# EAGLE schematic ebox (EAGLE 6.3)
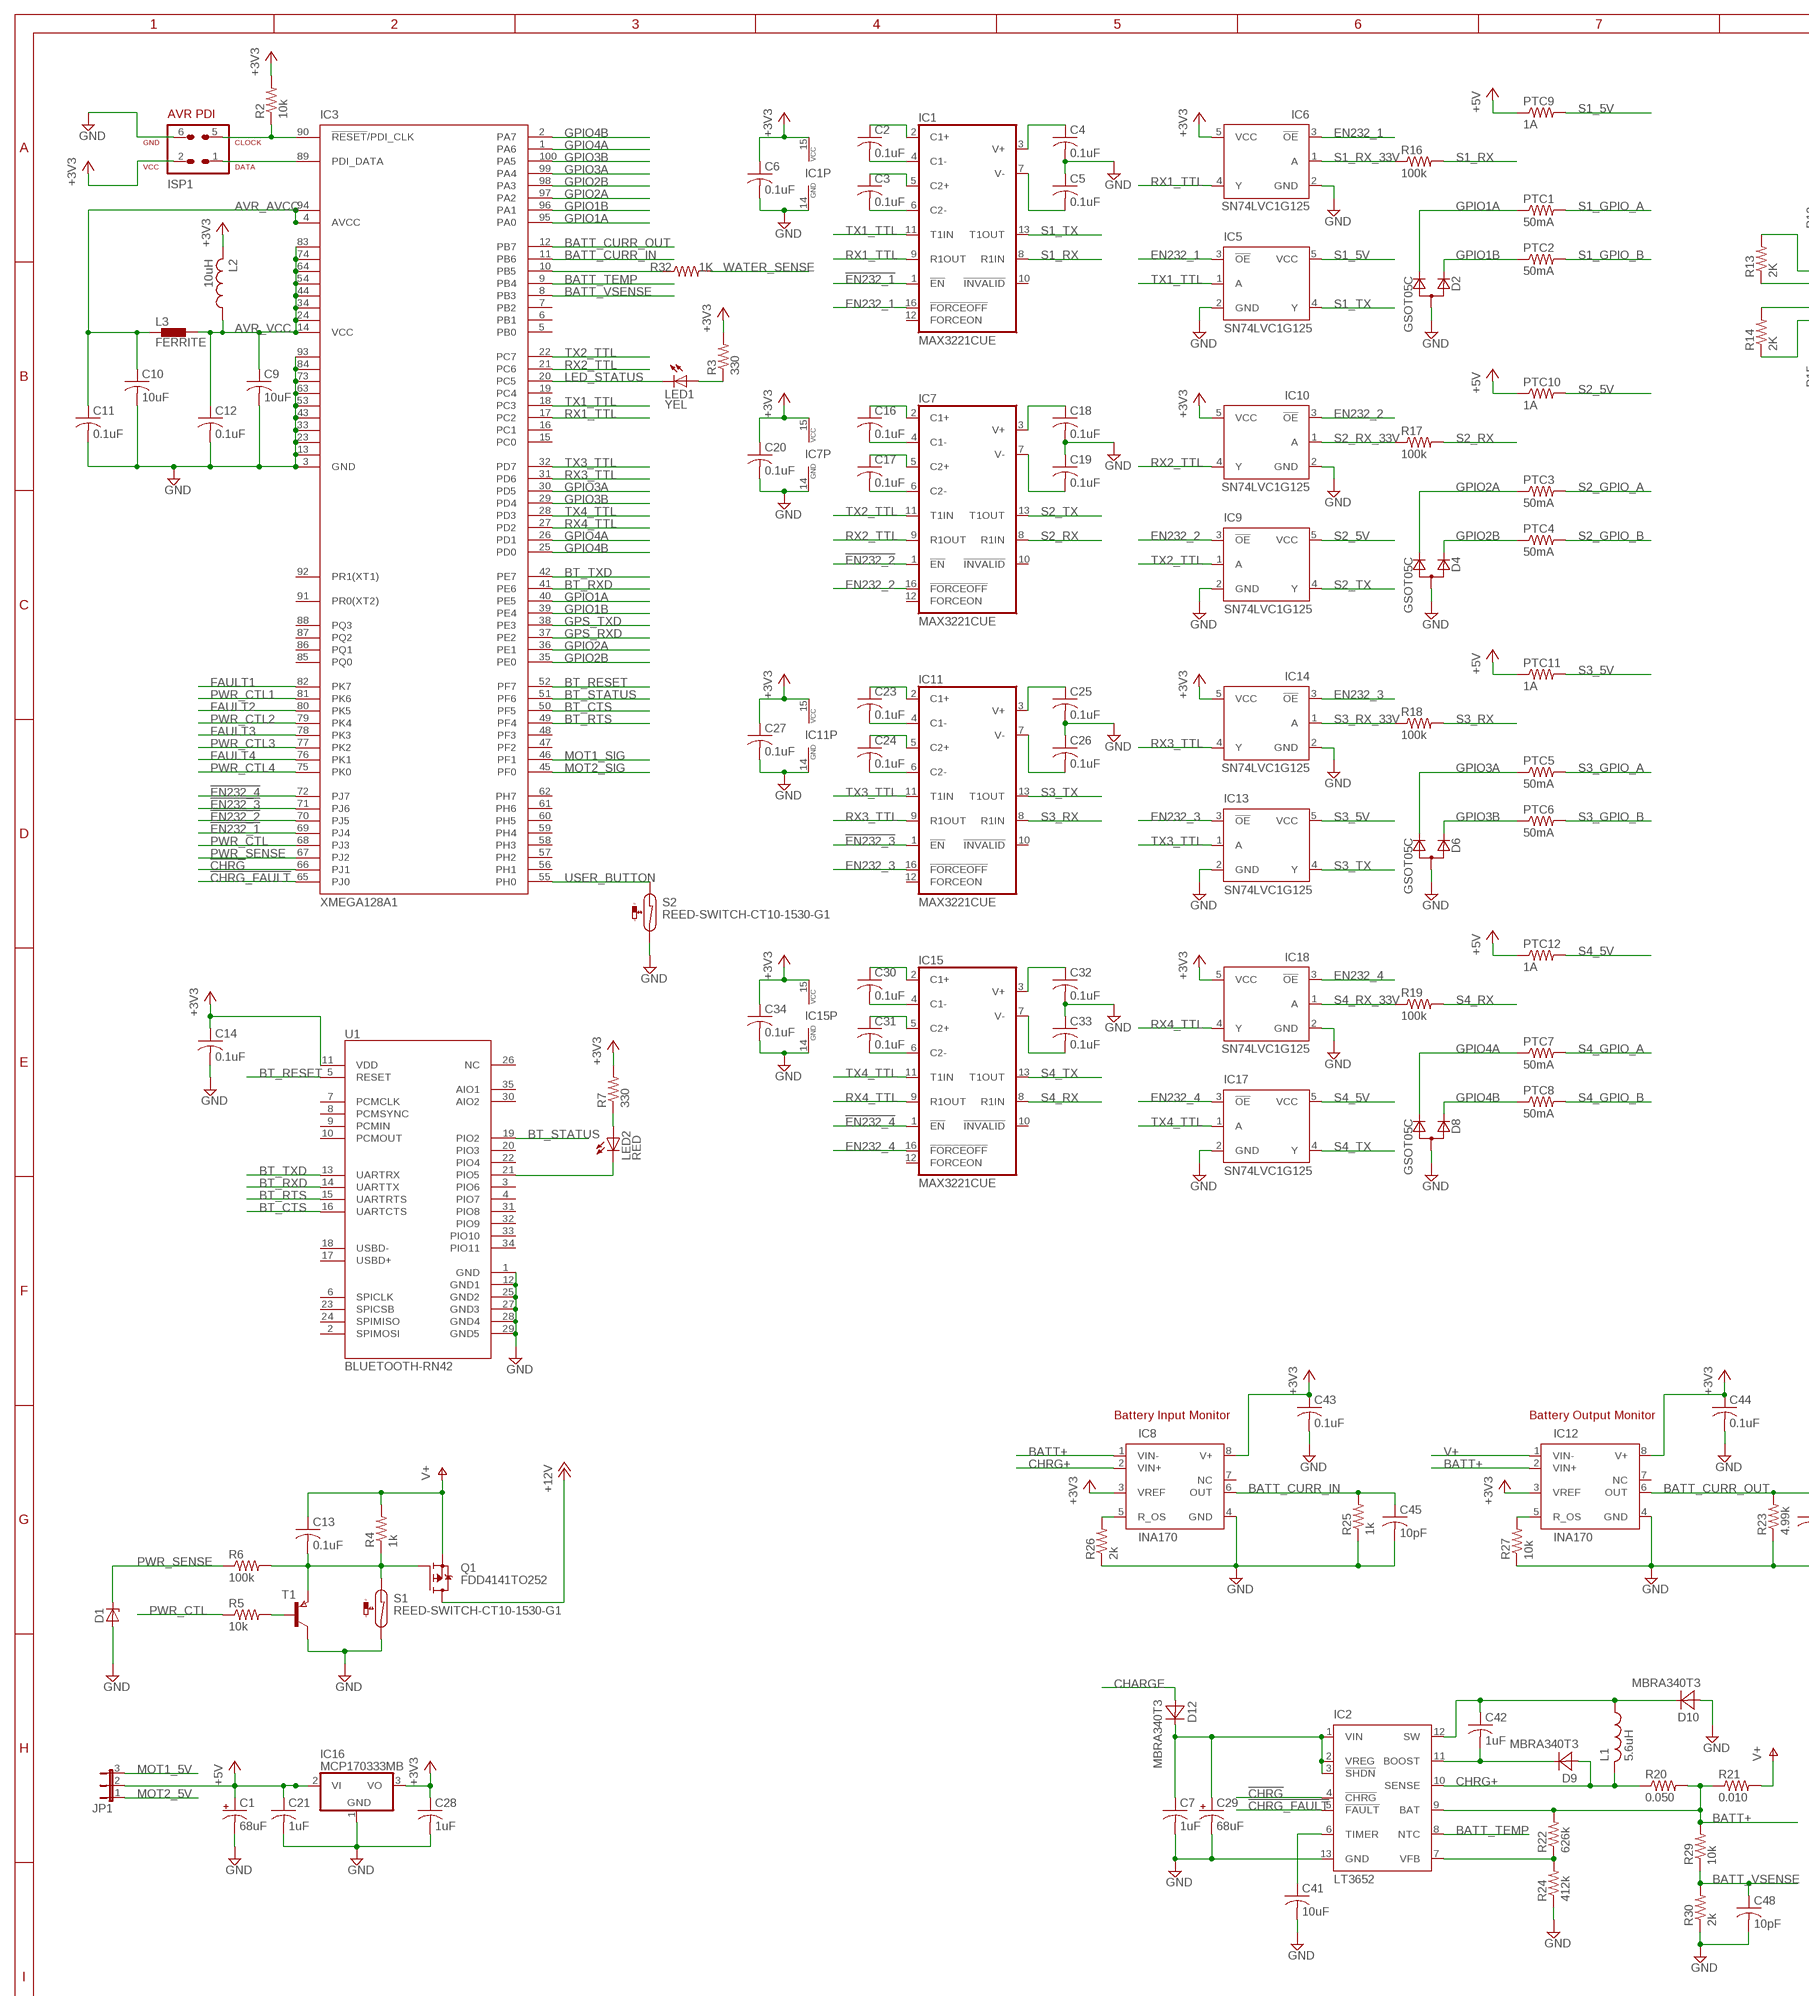
[diagram p0: schematic, sheet 1, part 1 of 2]
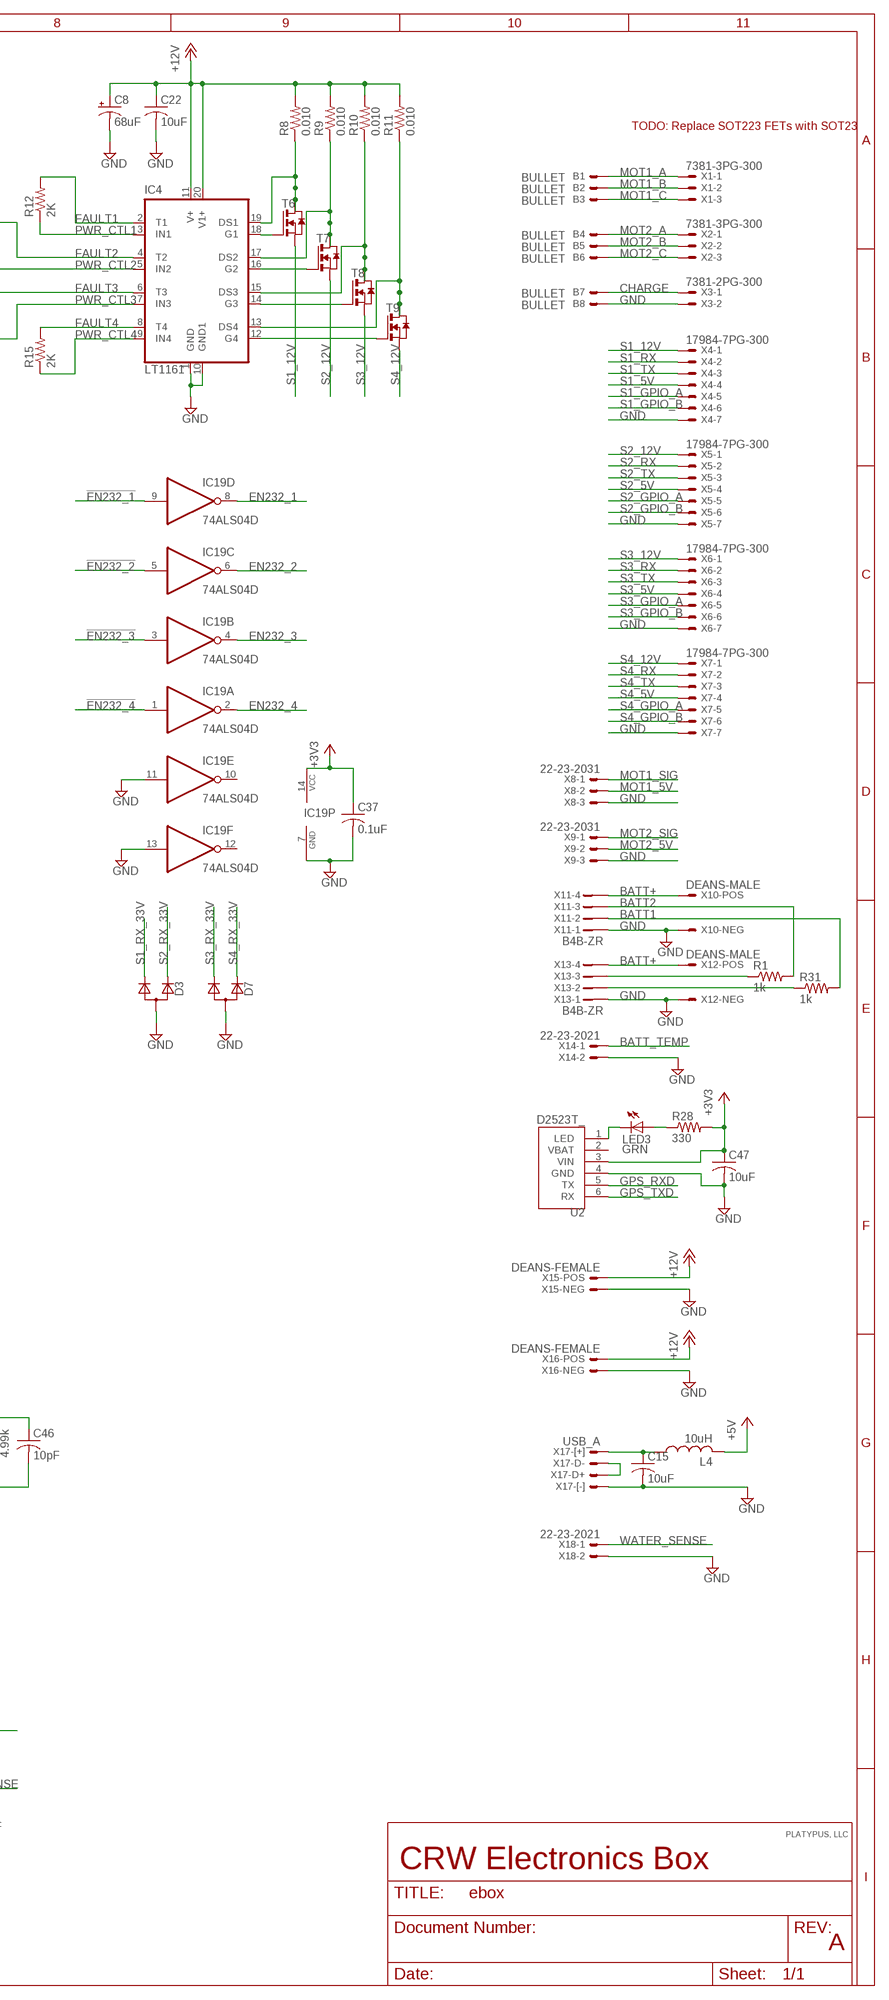
[diagram p1: schematic, sheet 1, part 2 of 2]

## Parts
B1  BULLET  [BULLET]
B2  BULLET  [BULLET]
B3  BULLET  [BULLET]
B4  BULLET  [BULLET]
B5  BULLET  [BULLET]
B6  BULLET  [BULLET]
B7  BULLET  [BULLET]
B8  BULLET  [BULLET]
C1  68uF  CPOL-USD  [PANASONIC_D]
C2  0.1uF  C-USC0805  [C0805]
C3  0.1uF  C-USC0805  [C0805]
C4  0.1uF  C-USC0805  [C0805]
C5  0.1uF  C-USC0805  [C0805]
C6  0.1uF  C-USC0805  [C0805]
C7  1uF  C-USC0805  [C0805]
C8  68uF  CPOL-USD  [PANASONIC_D]
C9  10uF  C-USC0805  [C0805]
C10  10uF  C-USC0805  [C0805]
C11  0.1uF  C-USC0805  [C0805]
C12  0.1uF  C-USC0805  [C0805]
C13  0.1uF  C-USC0805  [C0805]
C14  0.1uF  C-USC0805  [C0805]
C15  10uF  C-USC0805  [C0805]
C16  0.1uF  C-USC0805  [C0805]
C17  0.1uF  C-USC0805  [C0805]
C18  0.1uF  C-USC0805  [C0805]
C19  0.1uF  C-USC0805  [C0805]
C20  0.1uF  C-USC0805  [C0805]
C21  1uF  C-USC0805  [C0805]
C22  10uF  C-USC0805  [C0805]
C23  0.1uF  C-USC0805  [C0805]
C24  0.1uF  C-USC0805  [C0805]
C25  0.1uF  C-USC0805  [C0805]
C26  0.1uF  C-USC0805  [C0805]
C27  0.1uF  C-USC0805  [C0805]
C28  1uF  C-USC0805  [C0805]
C29  68uF  CPOL-USD  [PANASONIC_D]
C30  0.1uF  C-USC0805  [C0805]
C31  0.1uF  C-USC0805  [C0805]
C32  0.1uF  C-USC0805  [C0805]
C33  0.1uF  C-USC0805  [C0805]
C34  0.1uF  C-USC0805  [C0805]
C37  0.1uF  C-USC0805  [C0805]
C41  10uF  C-USC0805  [C0805]
C42  1uF  C-USC0805  [C0805]
C43  0.1uF  C-USC0805  [C0805]
C44  0.1uF  C-USC0805  [C0805]
C45  10pF  C-USC0805  [C0805]
C46  10pF  C-USC0805  [C0805]
C47  10uF  C-USC0805  [C0805]
C48  10pF  C-USC0805  [C0805]
D1  ZENER-DIODESOT23  [SOT23]
D2  GSOT05C  D_2CSOT23  [SOT-23]
D3  D_2CSOT23  [SOT-23]
D4  GSOT05C  D_2CSOT23  [SOT-23]
D6  GSOT05C  D_2CSOT23  [SOT-23]
D7  D_2CSOT23  [SOT-23]
D8  GSOT05C  D_2CSOT23  [SOT-23]
D9  MBRA340T3  [SMA]
D10  MBRA340T3  [SMA]
D12  MBRA340T3  [SMA]
IC1  MAX3221CUE  [TSSOP16]
IC2  LT3652  [MSOP12-MSE]
IC3  XMEGA128A1  [TQFP100]
IC4  LT1161  [SOIC20R]
IC5  SN74LVC1G125  [SOT23-DBV]
IC6  SN74LVC1G125  [SOT23-DBV]
IC7  MAX3221CUE  [TSSOP16]
IC8  INA170  [MSOP8]
IC9  SN74LVC1G125  [SOT23-DBV]
IC10  SN74LVC1G125  [SOT23-DBV]
IC11  MAX3221CUE  [TSSOP16]
IC12  INA170  [MSOP8]
IC13  SN74LVC1G125  [SOT23-DBV]
IC14  SN74LVC1G125  [SOT23-DBV]
IC15  MAX3221CUE  [TSSOP16]
IC16  MCP170333MB  [SOT89]
IC17  SN74LVC1G125  [SOT23-DBV]
IC18  SN74LVC1G125  [SOT23-DBV]
IC19  74ALS04D  [SO14]
ISP1  AVR-PDIVERT  [AVR-ISP-6]
JP1  JP2E  [JP2]
L1  5.6uH  IHLP-2020CZ-11  [IHLP-2020CZ-11]
L2  10uH  L-USL2012C  [L2012C]
L3  FERRITE  BML15HB121SN1  [0402]
L4  10uH  L-USL2012C  [L2012C]
LED1  YEL  LEDCHIPLED_1206  [CHIPLED_1206]
LED2  RED  LEDCHIPLED_1206  [CHIPLED_1206]
LED3  GRN  LEDCHIPLED_1206  [CHIPLED_1206]
PTC1  50mA  R-US_R1206  [R1206]
PTC2  50mA  R-US_R1206  [R1206]
PTC3  50mA  R-US_R1206  [R1206]
PTC4  50mA  R-US_R1206  [R1206]
PTC5  50mA  R-US_R1206  [R1206]
PTC6  50mA  R-US_R1206  [R1206]
PTC7  50mA  R-US_R1206  [R1206]
PTC8  50mA  R-US_R1206  [R1206]
PTC9  1A  R-US_R1206  [R1206]
PTC10  1A  R-US_R1206  [R1206]
PTC11  1A  R-US_R1206  [R1206]
PTC12  1A  R-US_R1206  [R1206]
Q1  FDD4141TO252  [TO252]
R1  1k  R-US_R0805  [R0805]
R2  10k  R-US_R0805  [R0805]
R3  330  R-US_R0805  [R0805]
R4  1k  R-US_R0805  [R0805]
R5  10k  R-US_R0805  [R0805]
R6  100k  R-US_R0805  [R0805]
R7  330  R-US_R0805  [R0805]
R8  0.010  R-US_R6332  [R6332]
R9  0.010  R-US_R6332  [R6332]
R10  0.010  R-US_R6332  [R6332]
R11  0.010  R-US_R6332  [R6332]
R12  2K  R-US_R0805  [R0805]
R13  2K  R-US_R0805  [R0805]
R14  2K  R-US_R0805  [R0805]
R15  2K  R-US_R0805  [R0805]
R16  100k  R-US_R0805  [R0805]
R17  100k  R-US_R0805  [R0805]
R18  100k  R-US_R0805  [R0805]
R19  100k  R-US_R0805  [R0805]
R20  0.050  R-US_R6332  [R6332]
R21  0.010  R-US_R6332  [R6332]
R22  626k  R-US_R0805  [R0805]
R23  4.99k  R-US_R0805  [R0805]
R24  412k  R-US_R0805  [R0805]
R25  1k  R-US_R0805  [R0805]
R26  2k  R-US_R0805  [R0805]
R27  10k  R-US_R0805  [R0805]
R28  330  R-US_R0805  [R0805]
R29  10k  R-US_R0805  [R0805]
R30  2k  R-US_R0805  [R0805]
R31  1k  R-US_R0805  [R0805]
R32  1K  R-US_R0805  [R0805]
S1  REED-SWITCH-CT10-1530-G1  [CT10-G1]
S2  REED-SWITCH-CT10-1530-G1  [CT10-G1]
T1  PNPSOT23  [SOT-23]
T6  NMOSSOT23-6  [SOT23-6]
T7  NMOSSOT23-6  [SOT23-6]
T8  NMOSSOT23-6  [SOT23-6]
T9  NMOSSOT23-6  [SOT23-6]
U1  BLUETOOTH-RN42  BLUETOOTH-RN41"  [RN41]
U2  D2523T_  [EM406]
U$1  PLATYPUS_LOGO  [PLATYPUS_LOGO_SMALL]
X1  7381-3PG-300  [7381-3PG-300]
X2  7381-3PG-300  [7381-3PG-300]
X3  7381-2PG-300  [7381-2PG-300]
X4  17984-7PG-300  [17984-7PG-300]
X5  17984-7PG-300  [17984-7PG-300]
X6  17984-7PG-300  [17984-7PG-300]
X7  17984-7PG-300  [17984-7PG-300]
X8  22-23-2031  [22-23-2031]
X9  22-23-2031  [22-23-2031]
X10  DEANS-MALE  [DEANS_MALE]
X11  B4B-ZR  [B4B-ZR]
X12  DEANS-MALE  [DEANS_MALE]
X13  B4B-ZR  [B4B-ZR]
X14  22-23-2021  [22-23-2021]
X15  DEANS-FEMALE  [DEANS_FEMALE]
X16  DEANS-FEMALE  [DEANS_FEMALE]
X17  USB_A  [1001-002-01100]
X18  22-23-2021  [22-23-2021]

## Nets
3ROU: IC4.18(G1) T6.4(G)
!CHRG: IC2.4(!CHRG) IC3.66(PJ1)
!CHRG_FAULT: IC2.5(!FAULT) IC3.65(PJ0)
!EN232_1: IC1.1(!EN) IC3.69(PJ4) IC19.9(D:I)
!EN232_2: IC3.70(PJ5) IC7.1(!EN) IC19.5(C:I)
!EN232_3: IC3.71(PJ6) IC11.1(!EN) IC19.3(B:I)
!EN232_4: IC3.72(PJ7) IC15.1(!EN) IC19.1(A:I)
+3V3: C6.1 C14.1 C20.1 C27.1 C28.1 C34.1 C37.1 C43.1 C44.1 C47.1 IC1.15(VCC) IC6.5(VCC) IC7.15(VCC) IC8.3(VREF) IC8.8(V+) IC10.5(VCC) IC11.15(VCC) IC12.3(VREF) IC12.8(V+) IC14.5(VCC) IC15.15(VCC) IC16.3(VO) IC18.5(VCC) IC19.14(P:VCC) ISP1.2 L2.2 R2.2 R3.2 R7.2 R28.2 U1.11(VDD) U2.3(VIN)
+5V: C1.+ C21.1 IC16.2(VI) IC16.2@1(VI1) JP1.2 L4.2 PTC9.1 PTC10.1 PTC11.1 PTC12.1
+12V: C8.+ C22.1 IC4.11(V+) IC4.20(V1+) Q1.3(D) R8.2 R9.2 R10.2 R11.2 X15.POS X16.POS
AVR_AVCC: C10.1 C11.1 IC3.4(AVCC) IC3.94(AVCC1) L3.1
AVR_VCC: C9.1 C12.1 IC3.14(VCC) IC3.24(VCC1) IC3.34(VCC2) IC3.44(VCC3) IC3.54(VCC4) IC3.64(VCC5) IC3.74(VCC6) IC3.83(VCC7) L2.1 L3.2
BATT1: R31.2 X11.2
BATT2: R1.2 X11.3
BATT+: IC2.9(BAT) IC8.1(VIN-) IC12.2(VIN+) R20.2 R21.1 R22.2 R29.2 X10.POS X11.4 X12.POS X13.4
BATT_CURR_IN: C45.1 IC3.11(PB6) IC8.6(OUT) R25.2
BATT_CURR_OUT: C46.1 IC3.12(PB7) IC12.6(OUT) R23.2
BATT_TEMP: IC2.8(NTC) IC3.9(PB4) X14.1
BATT_VSENSE: C48.1 IC3.8(PB3) R29.1 R30.2
BT_CTS: IC3.50(PF5) U1.16(UARTCTS)
BT_RESET: IC3.52(PF7) U1.5(RESET)
BT_RTS: IC3.49(PF4) U1.15(UARTRTS)
BT_RXD: IC3.41(PE6) U1.14(UARTTX)
BT_STATUS: IC3.51(PF6) U1.19(PIO2)
BT_TXD: IC3.42(PE7) U1.13(UARTRX)
CHARGE: B7.P$1(S) D12.A X3.1
CHRG+: D9.A IC2.10(SENSE) IC8.2(VIN+) L1.2 R20.1
EN232_1: IC1.16(!FORCEOFF) IC5.3(!OE) IC6.3(!OE) IC19.8(D:O)
EN232_2: IC7.16(!FORCEOFF) IC9.3(!OE) IC10.3(!OE) IC19.6(C:O)
EN232_3: IC11.16(!FORCEOFF) IC13.3(!OE) IC14.3(!OE) IC19.4(B:O)
EN232_4: IC15.16(!FORCEOFF) IC17.3(!OE) IC18.3(!OE) IC19.2(A:O)
FAULT1: IC3.82(PK7) IC4.2(T1) R12.2
FAULT2: IC3.80(PK5) IC4.4(T2) R13.2
FAULT3: IC3.78(PK3) IC4.6(T3) R14.2
FAULT4: IC3.76(PK1) IC4.8(T4) R15.2
GND: B8.P$1(S) C1.- C4.2 C5.1 C6.2 C7.2 C8.- C9.2 C10.2 C11.2 C12.2 C14.2 C15.2 C18.2 C19.1 C20.2 C21.2 C22.2 C25.2 C26.1 C27.2 C28.2 C29.- C32.2 C33.1 C34.2 C37.2 C41.2 C43.2 C44.2 C45.2 C46.2 C47.2 C48.2 D1.1(A) D2.1(A) D3.1(A) D4.1(A) D6.1(A) D7.1(A) D8.1(A) D10.A IC1.14(GND) IC2.13(GND) IC3.3(GND) IC3.13(GND1) IC3.23(GND2) IC3.33(GND3) IC3.43(GND4) IC3.53(GND5) IC3.63(GND6) IC3.73(GND7) IC3.84(GND8) IC3.93(GND9) IC4.1(GND) IC4.10(GND1) IC5.2(GND) IC6.2(GND) IC7.14(GND) IC8.4(GND) IC9.2(GND) IC10.2(GND) IC11.14(GND) IC12.4(GND) IC13.2(GND) IC14.2(GND) IC15.14(GND) IC16.1(GND) IC17.2(GND) IC18.2(GND) IC19.7(P:GND) IC19.11(E:I) IC19.13(F:I) ISP1.6 R23.1 R24.1 R25.1 R26.1 R27.1 R30.1 S1.2 S2.2 T1.1(C) U1.1(GND) U1.12(GND1) U1.25(GND2) U1.27(GND3) U1.28(GND4) U1.29(GND5) U2.4(GND) X3.2 X4.7 X5.7 X6.7 X7.7 X8.3 X9.3 X10.NEG X11.1 X12.NEG X13.1 X14.2 X15.NEG X16.NEG X17.4 X18.2
GPIO1A: D2.3(C2) IC3.40(PE5) IC3.95(PA0) PTC1.1
GPIO1B: D2.2(C1) IC3.39(PE4) IC3.96(PA1) PTC2.1
GPIO2A: D4.3(C2) IC3.36(PE1) IC3.97(PA2) PTC3.1
GPIO2B: D4.2(C1) IC3.35(PE0) IC3.98(PA3) PTC4.1
GPIO3A: D6.3(C2) IC3.30(PD5) IC3.99(PA4) PTC5.1
GPIO3B: D6.2(C1) IC3.29(PD4) IC3.100(PA5) PTC6.1
GPIO4A: D8.3(C2) IC3.1(PA6) IC3.26(PD1) PTC7.1
GPIO4B: D8.2(C1) IC3.2(PA7) IC3.25(PD0) PTC8.1
GPS_RXD: IC3.37(PE2) U2.5(TX)
GPS_TXD: IC3.38(PE3) U2.6(RX)
LED_STATUS: IC3.20(PC5) LED1.C
LED_STATUS1: LED2.C U1.21(PIO5)
MOT1_5V: JP1.3 X8.2
MOT1_A: B1.P$1(S) X1.1
MOT1_B: B2.P$1(S) X1.2
MOT1_C: B3.P$1(S) X1.3
MOT1_SIG: IC3.46(PF1) X8.1
MOT2_5V: JP1.1 X9.2
MOT2_A: B4.P$1(S) X2.1
MOT2_B: B5.P$1(S) X2.2
MOT2_C: B6.P$1(S) X2.3
MOT2_SIG: IC3.45(PF0) X9.1
N$1: C2.2 IC1.4(C1-)
N$2: C2.1 IC1.2(C1+)
N$3: C3.1 IC1.5(C2+)
N$4: C3.2 IC1.6(C2-)
N$5: IC3.90(!RESET!/PDI_CLK) ISP1.5 R2.1
N$6: LED1.A R3.1
N$7: IC3.89(PDI_DATA) ISP1.1
N$8: R5.2 T1.3(B)
N$9: LED2.A R7.1
N$10: C4.1 IC1.3(V+)
N$11: C5.2 IC1.7(V-)
N$12: IC4.19(DS1) R8.1 T6.1(D) T6.2(D1) T6.5(D2) T6.6(D3)
N$13: C13.2 Q1.1(G) R4.1 R6.2 S1.1 T1.2(E)
N$14: IC4.17(DS2) R9.1 T7.1(D) T7.2(D1) T7.5(D2) T7.6(D3)
N$15: IC4.15(DS3) R10.1 T8.1(D) T8.2(D1) T8.5(D2) T8.6(D3)
N$16: IC4.13(DS4) R11.1 T9.1(D) T9.2(D1) T9.5(D2) T9.6(D3)
N$17: IC3.10(PB5) R32.1
N$18: IC4.16(G2) T7.4(G)
N$19: IC4.14(G3) T8.4(G)
N$20: IC4.12(G4) T9.4(G)
N$21: C16.2 IC7.4(C1-)
N$22: C16.1 IC7.2(C1+)
N$23: C17.2 IC7.6(C2-)
N$24: C17.1 IC7.5(C2+)
N$25: C18.1 IC7.3(V+)
N$26: C19.2 IC7.7(V-)
N$27: C23.2 IC11.4(C1-)
N$28: C23.1 IC11.2(C1+)
N$29: C24.2 IC11.6(C2-)
N$30: C24.1 IC11.5(C2+)
N$31: C25.1 IC11.3(V+)
N$32: C26.2 IC11.7(V-)
N$33: C30.2 IC15.4(C1-)
N$34: C30.1 IC15.2(C1+)
N$35: C31.2 IC15.6(C2-)
N$36: C31.1 IC15.5(C2+)
N$37: C32.1 IC15.3(V+)
N$38: C33.2 IC15.7(V-)
N$39: C41.1 IC2.6(TIMER)
N$40: C15.1 L4.1 X17.1
N$41: C42.2 D9.C IC2.11(BOOST)
N$42: C42.1 D10.C IC2.12(SW) L1.1
N$43: LED3.C U2.1(LED)
N$44: IC2.7(VFB) R22.1 R24.2
N$45: X17.2 X17.3
N$46: R1.1 X13.3
N$47: C7.1 C29.+ D12.C IC2.1(VIN) IC2.2(VREG) IC2.3(!SHDN)
N$48: IC8.5(R_OS) R26.2
N$49: IC12.5(R_OS) R27.2
N$50: LED3.A R28.1
N$51: R31.1 X13.2
PWR_CTL: IC3.68(PJ3) R5.1
PWR_CTL1: IC3.81(PK6) IC4.3(IN1) R12.1
PWR_CTL2: IC3.79(PK4) IC4.5(IN2) R13.1
PWR_CTL3: IC3.77(PK2) IC4.7(IN3) R14.1
PWR_CTL4: IC3.75(PK0) IC4.9(IN4) R15.1
PWR_SENSE: D1.3(C) IC3.67(PJ2) R6.1
RX1_TTL: IC1.9(R1OUT) IC3.17(PC2) IC6.4(Y)
RX2_TTL: IC3.21(PC6) IC7.9(R1OUT) IC10.4(Y)
RX3_TTL: IC3.31(PD6) IC11.9(R1OUT) IC14.4(Y)
RX4_TTL: IC3.27(PD2) IC15.9(R1OUT) IC18.4(Y)
S1_5V: IC5.5(VCC) PTC9.2 X4.4
S1_12V: T6.3(S) X4.1
S1_GPIO_A: PTC1.2 X4.5
S1_GPIO_B: PTC2.2 X4.6
S1_RX: IC1.8(R1IN) R16.2 X4.2
S1_RX_33V: D3.3(C2) IC6.1(A) R16.1
S1_TX: IC1.13(T1OUT) IC5.4(Y) X4.3
S2_5V: IC9.5(VCC) PTC10.2 X5.4
S2_12V: T7.3(S) X5.1
S2_GPIO_A: PTC3.2 X5.5
S2_GPIO_B: PTC4.2 X5.6
S2_RX: IC7.8(R1IN) R17.2 X5.2
S2_RX_33V: D3.2(C1) IC10.1(A) R17.1
S2_TX: IC7.13(T1OUT) IC9.4(Y) X5.3
S3_5V: IC13.5(VCC) PTC11.2 X6.4
S3_12V: T8.3(S) X6.1
S3_GPIO_A: PTC5.2 X6.5
S3_GPIO_B: PTC6.2 X6.6
S3_RX: IC11.8(R1IN) R18.2 X6.2
S3_RX_33V: D7.3(C2) IC14.1(A) R18.1
S3_TX: IC11.13(T1OUT) IC13.4(Y) X6.3
S4_5V: IC17.5(VCC) PTC12.2 X7.4
S4_12V: T9.3(S) X7.1
S4_GPIO_A: PTC7.2 X7.5
S4_GPIO_B: PTC8.2 X7.6
S4_RX: IC15.8(R1IN) R19.2 X7.2
S4_RX_33V: D7.2(C1) IC18.1(A) R19.1
S4_TX: IC15.13(T1OUT) IC17.4(Y) X7.3
TX1_TTL: IC1.11(T1IN) IC3.18(PC3) IC5.1(A)
TX2_TTL: IC3.22(PC7) IC7.11(T1IN) IC9.1(A)
TX3_TTL: IC3.32(PD7) IC11.11(T1IN) IC13.1(A)
TX4_TTL: IC3.28(PD3) IC15.11(T1IN) IC17.1(A)
USER_BUTTON: IC3.55(PH0) S2.1
V+: C13.1 IC12.1(VIN-) Q1.2(S) R4.2 R21.2
WATER_SENSE: R32.2 X18.1
Unconnected: IC1.10(!INVALID) IC1.12(FORCEON) IC3.5(PB0) IC3.6(PB1) IC3.7(PB2) IC3.15(PC0) IC3.16(PC1) IC3.19(PC4) IC3.47(PF2) IC3.48(PF3) IC3.56(PH1) IC3.57(PH2) IC3.58(PH3) IC3.59(PH4) IC3.60(PH5) IC3.61(PH6) IC3.62(PH7) IC3.85(PQ0) IC3.86(PQ1) IC3.87(PQ2) IC3.88(PQ3) IC3.91(PR0(XT2)) IC3.92(PR1(XT1)) IC7.10(!INVALID) IC7.12(FORCEON) IC8.7(NC) IC11.10(!INVALID) IC11.12(FORCEON) IC12.7(NC) IC15.10(!INVALID) IC15.12(FORCEON) IC19.10(E:O) IC19.12(F:O) U1.2(SPIMOSI) U1.3(PIO6) U1.4(PIO7) U1.6(SPICLK) U1.7(PCMCLK) U1.8(PCMSYNC) U1.9(PCMIN) U1.10(PCMOUT) U1.17(USBD+) U1.18(USBD-) U1.20(PIO3) U1.22(PIO4) U1.23(SPICSB) U1.24(SPIMISO) U1.26(NC) U1.30(AIO2) U1.31(PIO8) U1.32(PIO9) U1.33(PIO10) U1.34(PIO11) U1.35(AIO1) U2.2(VBAT)

## Notes on the sheet
- TODO: Replace SOT223 FETs with SOT23
- Battery Input Monitor | Battery Output Monitor
- CRW Electronics Box
- A

## Library data of the parts
B1-B8 = crw:BULLET: Bullet Connector Gold-plated 3.5mm bullet connector
C1 C8 C29 = rcl:CPOL-US: POLARIZED CAPACITOR, American symbol
C2-C7 C9-C28 C30-C34 C37 C41-C48 = rcl:C-US: CAPACITOR, American symbol
D1 = diode:ZENER-DIODE: Z-Diode
D2-D4 D6-D8 = zetex:D_2C: Dual DIODE; OC_FARNELL: unknown; OC_NEWARK: unknown
D9 D10 D12 = diode:MBRA340T3: Surface Mount Schottky Power Rectifier Source: http://www.onsemi.com/pub_link/Collateral/MBRA340T3-D.PDF
IC1 IC7 IC11 IC15 = maxim:MAX3221*: RS-232 Transceivers with AutoShutdown 1µA Supply-Current, True +3V to +5.5V http://dbserv.maxim-ic.com/; MF: MAXIM; MPN: MAX3221CUE+; OC_FARNELL: 1379915; OC_NEWARK: 68K4608
IC2 = crw:LT3652: 2-Channel, 12-Bit ADC with I2C-Compatible Interface 10-Lead MSOP Source: http://www.analog.com/UploadedFiles/Data_Sheets/224965274AD7992_0.pdf; MPN: AD7992BRMZ-0; OC_FARNELL: 1078311; OC_NEWARK: 31M4422
IC3 = atmel:XMEGA128A1: MICROCONTROLLER Features High-performance, Low-power 8/16-bit AVR XMEGA Microcontroller Non-Volatile Program and Data Memories - 64K - 384K Bytes of In-System Self-Programmable Flash - 4K - 8K Bytes Boot Section with Independent Lock Bits - 2 KB - 4 KB EEPROM - 4 KB - 32 KB Internal SRAM External Bus Interface for up to 16M bytes SRAM External Bus Interface for up to 128M bit SDRAM Peripheral Features - Four-channel DMA Controller with support for external requests - Eight-channel Event System - Eight 16-bit Timer/Counters Four Timer/Counters with 4 Output Compare or Input Capture channels Four Timer/Counters with 2 Output Compare or Input Capture channels High-Resolution Extension on all Timer/Counters Advanced Waveform Extension on two Timer/Counters - Eight USARTs IrDA modulation/demodulation for one USART - Four Two-Wire Interfaces with dual address match (I2C and SMBus compatible) - Four SPI (Serial Peripheral Interface) peripherals - AES and DES Crypto Engine - 16-bit Real Time Counter with separate Oscillator - Two Eight-channel, 12-bit, 2 Msps Analog to Digital Converters - Two Two-channel, 12-bit, 1 Msps Digital to Analog Converters - Four Analog Comparators with Window compare function - External Interrupts on all General Purpose I/O pins - Programmable Watchdog Timer with Separate On-chip Ultra Low Power Oscillator Special Microcontroller Features - Power-on Reset and Programmable Brown-out Detection - Internal and External Clock Options with PLL and Prescaler - Programmable Multi-level Interrupt Controller - Sleep Modes: Idle, Power-down, Standby, Power-save, Extended Standby - Advanced Programming, Test and Debugging Interfaces JTAG (IEEE 1149.1 Compliant) Interface for programming, test and debugging PDI (Program and Debug Interface) for programming and debugging I/O and Packages - 78 Programmable I/O Lines - 100 - lead TQFP - 100 - ball CBGA - 100 - ball VFBGA Operating Voltage - 1.6 - 3.6V Speed performance - 0 - 12 MHz @ 1.6 - 3.6V - 0 - 32 MHz @ 2.7 - 3.6V Drawn by Dipl.-Ing. (FH) Robert Siegler Created: 27.05.09; OC_FARNELL: unknown; OC_NEWARK: unknown
IC4 = crw:LT1161: Single-Supply 16-Bit Stereo ADC Source: http://www.analog.com/static/imported-files/data_sheets/AD1877.pdf
IC5 IC6 IC9 IC10 IC13 IC14 IC17 IC18 = crw:SN74LVC1G125: SINGLE BUS BUFFER GATE WITH 3-STATE OUTPUT Source: http://www.ti.com/lit/ds/symlink/sn74lvc1g125.pdf
IC8 IC12 = crw:INA170: High-Side, Bidirectional CURRENT SHUNT MONITOR
IC16 = linear:MCP1703*: 250 mA, 16V, Low Quiescent Current LDO Regulator Source: http://ww1.microchip.com/downloads/en/DeviceDoc/22049b.pdf
IC19 = 74xx-us:74*04: Hex INVERTER
ISP1 = avr-7:AVR-PDI: AVR PDI programming interface connector
JP1 = jumper:JP2E: JUMPER
L1 = crw:IHLP-2020CZ-11
L2 L4 = rcl:L-US: INDUCTOR, American symbol
L3 = inductors:BML15H: EMIFIL (R) Chip Ferrite Bead for GHz Noise Source: http://www.murata.com/ Ferrite Bead BLM15H.pdf
LED1-LED3 = led:LED: LED OSRAM: - CHIPLED LG R971, LG N971, LY N971, LG Q971, LY Q971, LO R971, LY R971 LH N974, LH R974 LS Q976, LO Q976, LY Q976 LO Q996 - Hyper CHIPLED LW Q18S LB Q993, LB Q99A, LB R99A - SideLED LS A670, LO A670, LY A670, LG A670, LP A670 LB A673, LV A673, LT A673, LW A673 LH A674 LY A675 LS A676, LA A676, LO A676, LY A676, LW A676 LS A679, LY A679, LG A679 - Hyper Micro SIDELED® LS Y876, LA Y876, LO Y876, LY Y876 LT Y87S - SmartLED LW L88C, LW L88S LB L89C, LB L89S, LG L890 LS L89K, LO L89K, LY L89K LS L896, LA L896, LO L896, LY L896 - TOPLED LS T670, LO T670, LY T670, LG T670, LP T670 LSG T670, LSP T670, LSY T670, LOP T670, LYG T670 LG T671, LOG T671, LSG T671 LB T673, LV T673, LT T673, LW T673 LH T674 LS T676, LA T676, LO T676, LY T676, LB T676, LH T676, LSB T676, LW T676 LB T67C, LV T67C, LT T67C, LS T67K, LO T67K, LY T67K, LW E67C LS E67B, LA E67B, LO E67B, LY E67B, LB E67C, LV E67C, LT E67C LW T67C LS T679, LY T679, LG T679 LS T770, LO T770, LY T770, LG T770, LP T770 LB T773, LV T773, LT T773, LW T773 LH T774 LS E675, LA E675, LY E675, LS T675 LS T776, LA T776, LO T776, LY T776, LB T776 LHGB T686 LT T68C, LB T68C - Hyper Mini TOPLED® LB M676 - Mini TOPLED Santana® LG M470 LS M47K, LO M47K, LY M47K Source: http://www.osram.convergy.de LUXEON: - LUMILED® LXK2-PW12-R00, LXK2-PW12-S00, LXK2-PW14-U00, LXK2-PW14-V00 LXK2-PM12-R00, LXK2-PM12-S00, LXK2-PM14-U00 LXK2-PE12-Q00, LXK2-PE12-R00, LXK2-PE12-S00, LXK2-PE14-T00, LXK2-PE14-U00 LXK2-PB12-K00, LXK2-PB12-L00, LXK2-PB12-M00, LXK2-PB14-N00, LXK2-PB14-P00, LXK2-PB14-Q00 LXK2-PR12-L00, LXK2-PR12-M00, LXK2-PR14-Q00, LXK2-PR14-R00 LXK2-PD12-Q00, LXK2-PD12-R00, LXK2-PD12-S00 LXK2-PH12-R00, LXK2-PH12-S00 LXK2-PL12-P00, LXK2-PL12-Q00, LXK2-PL12-R00 Source: www.luxeon.com KINGBRIGHT: KA-3528ASYC Source: www.kingbright.com
PTC1-PTC12 R1-R32 = rcl:R-US_: RESISTOR, American symbol
Q1 = transistor-fet:FDD4141: P-Channel PowerTrench® MOSFET Source: FDD4141.pdf
S1 S2 = switch-reed:REED-SWITCH-: Reed Sensor; MF: COTO TECHNOLOGY; MPN: CT10-1530-G1; OC_FARNELL: 1081696
T1 = zetex:PNPSOT23: PNP TRANSISTOR; MPN: DSS20200L-7; OC_FARNELL: unknown; OC_NEWARK: 25R4554
T6-T9 = zetex:NMOSSOT23-6: MOS FET; OC_FARNELL: unknown; OC_NEWARK: unknown
U1 = SparkFun-RF:BLUETOOTH-RN41: Bluetooth SMD module
U2 = SparkFun-RF:D2523T: D2523T GPS Module
U$1 = crw:PLATYPUS_LOGO
X1 X2 = crw:7381-3PG-300: Mini-Con-X Panel Connector Mini-Con-X 3-position Panel Mount connector; #16 gold plated P/C tail .187 style Pins; standard panel mount backshell
X3 = crw:7381-2PG-300
X4-X7 = crw:17984-7PG-300: MICRO-CON-X® FIELD INSTALLABLE CONNECTOR Micro-Con-X panel mount connector; 7 position, B key, #26 gold plated P/C tail .187 style male pins; standard panel mount hardware; standard thermoplastic insert; 17984-7PG-300
X8 X9 = con-molex:22-23-2031: .100" (2.54mm) Center Header - 3 Pin; MF: MOLEX; MPN: 22-23-2031; OC_FARNELL: 1462950; OC_NEWARK: 30C0862
X10 X12 X15 X16 = crw:DEANS: Deans Battery Connector
X11 X13 = con-jst:?4B-ZR: ZH CONNECTOR 1.5 mm, 4 pin 1 row Source: http://www.jst.com .. eZH.pdf; MF: FARNELL; MPN: B4B-ZR(LF)(SN); OC_FARNELL: 1830916; OC_NEWARK: 37K9960
X14 X18 = con-molex:22-23-2021: .100" (2.54mm) Center Header - 2 Pin; MF: MOLEX; MPN: 22-23-2021; OC_FARNELL: 1462926; OC_NEWARK: 25C3832
X17 = crw:USB_A: USB A-type connector